# EAGLE schematic ATW-Farmcard (EAGLE 5.12)

## Sheet 1 of 2
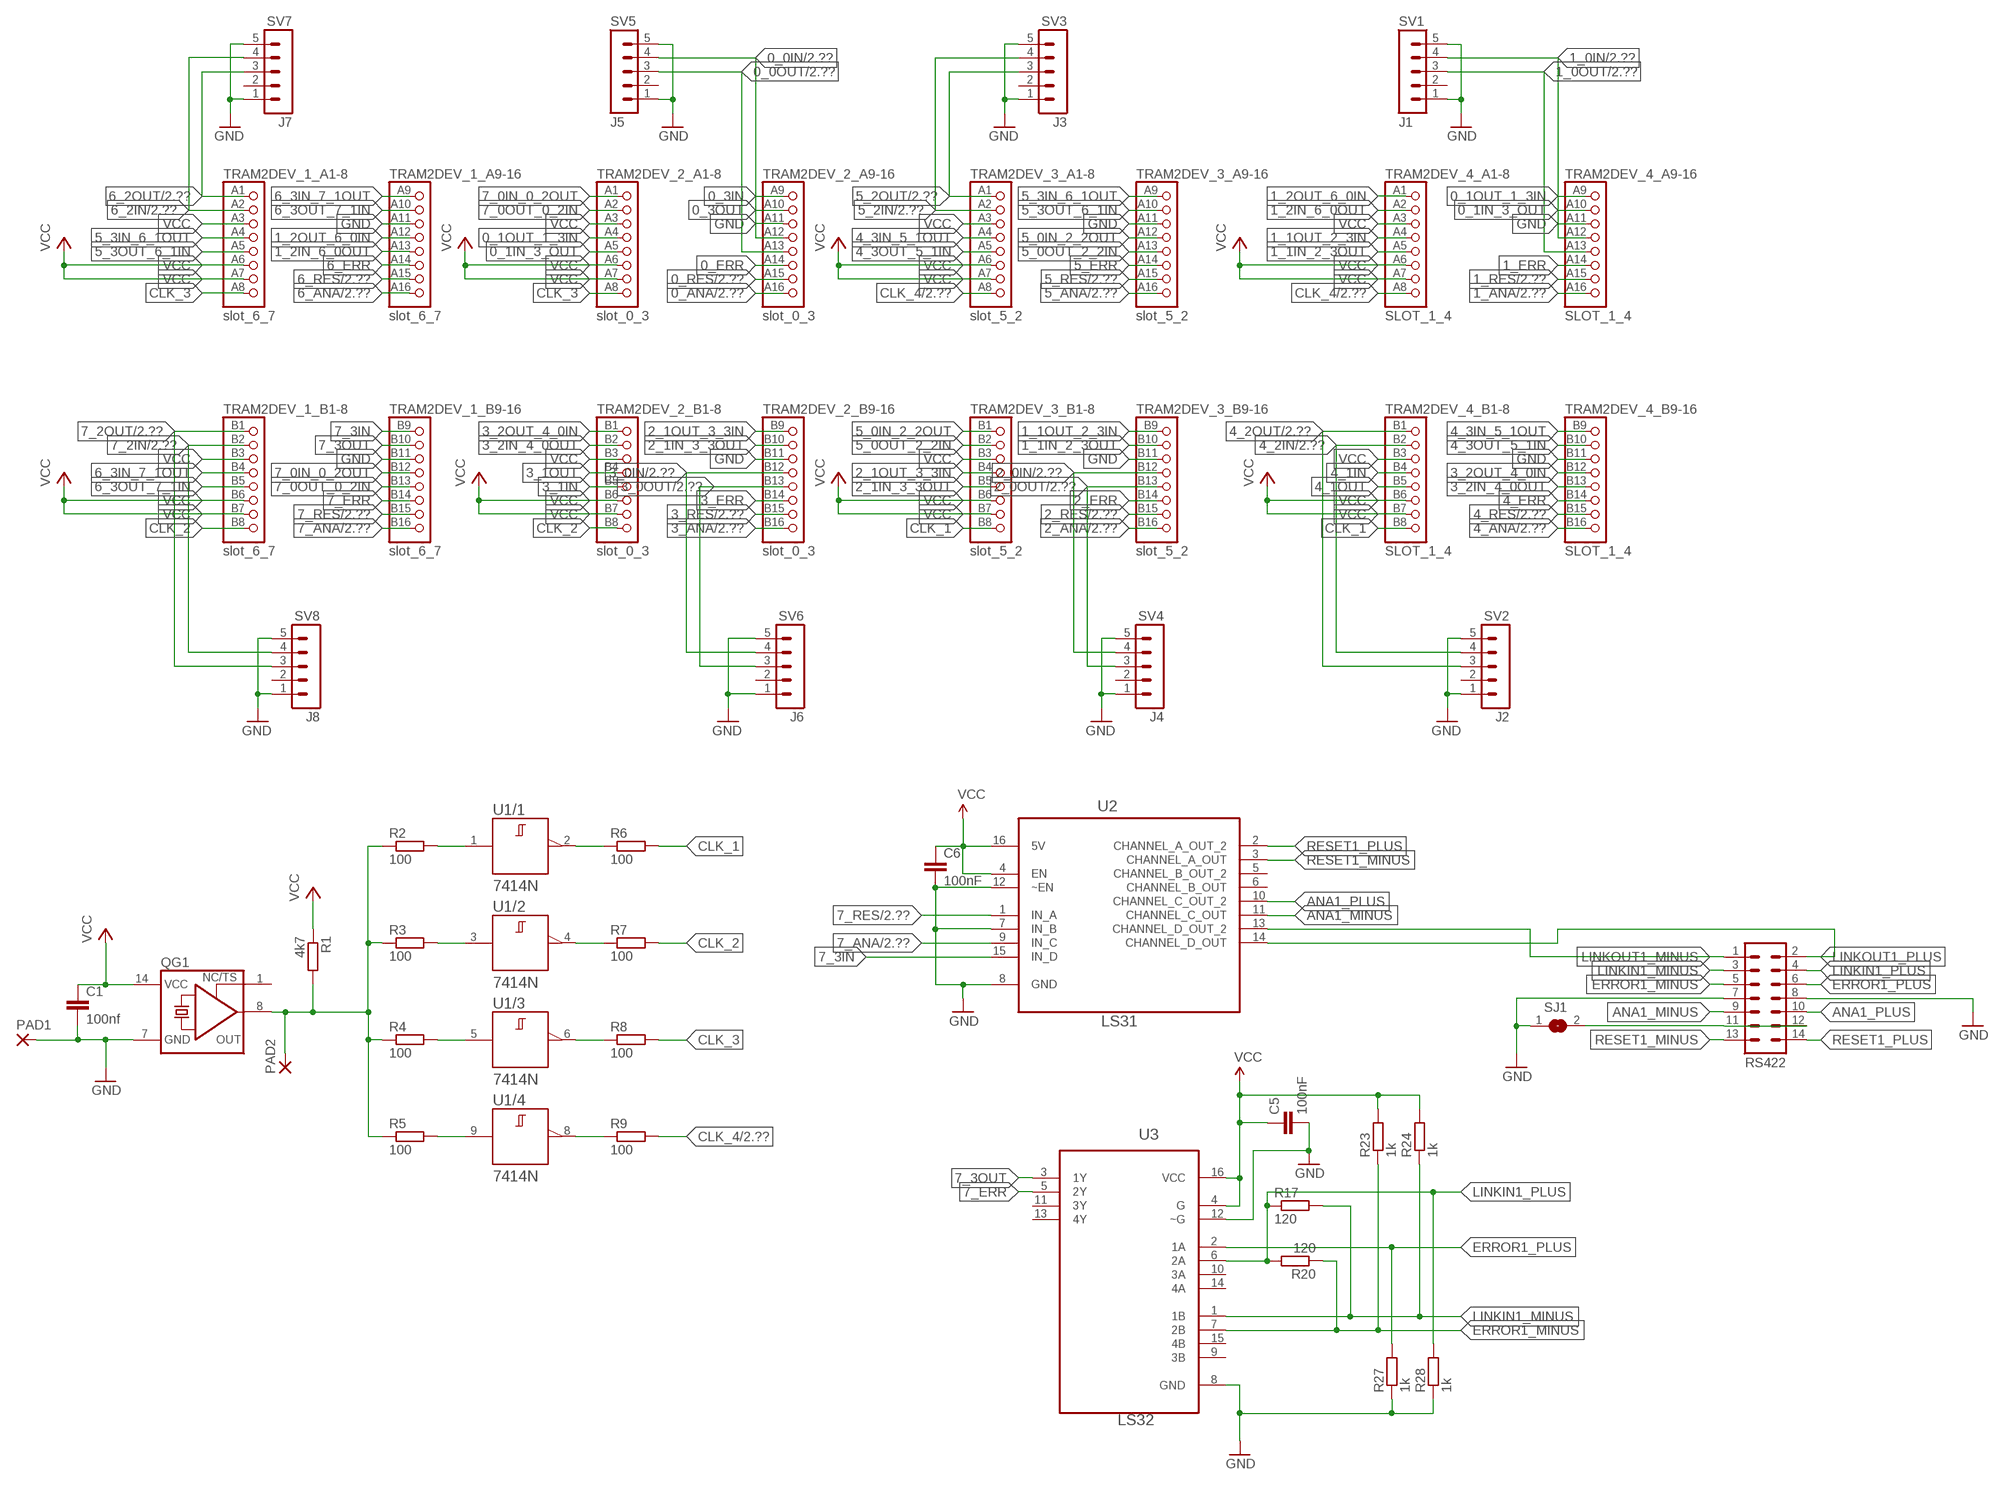
[diagram p0: schematic, sheet 1]

### Parts
C1  100nf  C-EU025-025X050  [C025-025X050]
C5  100nF  C-EU025-025X050  [C025-025X050]
C6  100nF  C-EU025-025X050  [C025-025X050]
PAD1  1,6/0,9  [1,6/0,9]
PAD2  1,6/0,9  [1,6/0,9]
QG1  XO-14  [DIL14S]
R1  4k7  R-EU_0204/5  [0204/5]
R2  100  R-EU_0204/5  [0204/5]
R3  100  R-EU_0204/5  [0204/5]
R4  100  R-EU_0204/5  [0204/5]
R5  100  R-EU_0204/5  [0204/5]
R6  100  R-EU_0204/5  [0204/5]
R7  100  R-EU_0204/5  [0204/5]
R8  100  R-EU_0204/5  [0204/5]
R9  100  R-EU_0204/5  [0204/5]
R17  120  R-EU_0204/5  [0204/5]
R20  120  R-EU_0204/5  [0204/5]
R23  1k  R-EU_0204/5  [0204/5]
R24  1k  R-EU_0204/5  [0204/5]
R27  1k  R-EU_0204/5  [0204/5]
R28  1k  R-EU_0204/5  [0204/5]
RS422  ML14L  [ML14L]
SJ1  SJ  [SJ]
SV1  J1  MA05-1  [MA05-1]
SV2  J2  MA05-1  [MA05-1]
SV3  J3  MA05-1  [MA05-1]
SV4  J4  MA05-1  [MA05-1]
SV5  J5  MA05-1  [MA05-1]
SV6  J6  MA05-1  [MA05-1]
SV7  J7  MA05-1  [MA05-1]
SV8  J8  MA05-1  [MA05-1]
TRAM2DEV_1  slot_6_7  TRAM2SOCK  [TRAM_SIZE2_SOCKET]
TRAM2DEV_2  slot_0_3  TRAM2SOCK  [TRAM_SIZE2_SOCKET]
TRAM2DEV_3  slot_5_2  TRAM2SOCK  [TRAM_SIZE2_SOCKET]
TRAM2DEV_4  SLOT_1_4  TRAM2SOCK  [TRAM_SIZE2_SOCKET]
U1  7414N  [DIL14]
U2  LS31  AM26LS31CN  [DIP254P762X508-16]
U3  LS32  AM26LS32IN  [DIP254P762X508-16]

### Nets
0_0IN: SV5.4 TRAM2DEV_2.A12 ; also sheet 2
0_0OUT: SV5.3 TRAM2DEV_2.A13 ; also sheet 2
0_1IN_3_OUT: TRAM2DEV_2.A5 TRAM2DEV_4.A10
0_1OUT_1_3IN: TRAM2DEV_2.A4 TRAM2DEV_4.A9
0_3IN: TRAM2DEV_2.A9
0_3OUT: TRAM2DEV_2.A10
0_ANA: TRAM2DEV_2.A16 ; also sheet 2
0_ERR: TRAM2DEV_2.A14
0_RES: TRAM2DEV_2.A15 ; also sheet 2
1_0IN: SV1.4 TRAM2DEV_4.A12 ; also sheet 2
1_0OUT: SV1.3 TRAM2DEV_4.A13 ; also sheet 2
1_1IN_2_3OUT: TRAM2DEV_3.B10 TRAM2DEV_4.A5
1_1OUT_2_3IN: TRAM2DEV_3.B9 TRAM2DEV_4.A4
1_2IN_6_0OUT: TRAM2DEV_1.A13 TRAM2DEV_4.A2
1_2OUT_6_0IN: TRAM2DEV_1.A12 TRAM2DEV_4.A1
1_ANA: TRAM2DEV_4.A16 ; also sheet 2
1_ERR: TRAM2DEV_4.A14
1_RES: TRAM2DEV_4.A15 ; also sheet 2
2_0IN: SV4.4 TRAM2DEV_3.B12 ; also sheet 2
2_0OUT: SV4.3 TRAM2DEV_3.B13 ; also sheet 2
2_1IN_3_3OUT: TRAM2DEV_2.B10 TRAM2DEV_3.B5
2_1OUT_3_3IN: TRAM2DEV_2.B9 TRAM2DEV_3.B4
2_ANA: TRAM2DEV_3.B16 ; also sheet 2
2_ERR: TRAM2DEV_3.B14
2_RES: TRAM2DEV_3.B15 ; also sheet 2
3_0IN: SV6.4 TRAM2DEV_2.B12 ; also sheet 2
3_0OUT: SV6.3 TRAM2DEV_2.B13 ; also sheet 2
3_1IN: TRAM2DEV_2.B5
3_1OUT: TRAM2DEV_2.B4
3_2IN_4_0OUT: TRAM2DEV_2.B2 TRAM2DEV_4.B13
3_2OUT_4_0IN: TRAM2DEV_2.B1 TRAM2DEV_4.B12
3_ANA: TRAM2DEV_2.B16 ; also sheet 2
3_ERR: TRAM2DEV_2.B14
3_RES: TRAM2DEV_2.B15 ; also sheet 2
4_1IN: TRAM2DEV_4.B4
4_1OUT: TRAM2DEV_4.B5
4_2IN: SV2.4 TRAM2DEV_4.B2 ; also sheet 2
4_2OUT: SV2.3 TRAM2DEV_4.B1 ; also sheet 2
4_3IN_5_1OUT: TRAM2DEV_3.A4 TRAM2DEV_4.B9
4_3OUT_5_1IN: TRAM2DEV_3.A5 TRAM2DEV_4.B10
4_ANA: TRAM2DEV_4.B16 ; also sheet 2
4_ERR: TRAM2DEV_4.B14
4_RES: TRAM2DEV_4.B15 ; also sheet 2
5_0IN_2_2OUT: TRAM2DEV_3.A12 TRAM2DEV_3.B1
5_0OUT_2_2IN: TRAM2DEV_3.A13 TRAM2DEV_3.B2
5_2IN: SV3.4 TRAM2DEV_3.A2 ; also sheet 2
5_2OUT: SV3.3 TRAM2DEV_3.A1 ; also sheet 2
5_3IN_6_1OUT: TRAM2DEV_1.A4 TRAM2DEV_3.A9
5_3OUT_6_1IN: TRAM2DEV_1.A5 TRAM2DEV_3.A10
5_ANA: TRAM2DEV_3.A16 ; also sheet 2
5_ERR: TRAM2DEV_3.A14
5_RES: TRAM2DEV_3.A15 ; also sheet 2
6_2IN: SV7.4 TRAM2DEV_1.A2 ; also sheet 2
6_2OUT: SV7.3 TRAM2DEV_1.A1 ; also sheet 2
6_3IN_7_1OUT: TRAM2DEV_1.A9 TRAM2DEV_1.B4
6_3OUT_7_1IN: TRAM2DEV_1.A10 TRAM2DEV_1.B5
6_ANA: TRAM2DEV_1.A16 ; also sheet 2
6_ERR: TRAM2DEV_1.A14
6_RES: TRAM2DEV_1.A15 ; also sheet 2
7_0IN_0_2OUT: TRAM2DEV_1.B12 TRAM2DEV_2.A1
7_0OUT_0_2IN: TRAM2DEV_1.B13 TRAM2DEV_2.A2
7_2IN: SV8.4 TRAM2DEV_1.B2 ; also sheet 2
7_2OUT: SV8.3 TRAM2DEV_1.B1 ; also sheet 2
7_3IN: TRAM2DEV_1.B9 U2.15(IN_D)
7_3OUT: TRAM2DEV_1.B10 U3.3(1Y)
7_ANA: TRAM2DEV_1.B16 U2.9(IN_C) ; also sheet 2
7_ERR: TRAM2DEV_1.B14 U3.5(2Y)
7_RES: TRAM2DEV_1.B15 U2.1(IN_A) ; also sheet 2
ANA1_MINUS: RS422.9 U2.11(CHANNEL_C_OUT)
ANA1_PLUS: RS422.10 U2.10(CHANNEL_C_OUT_2)
CLK_1: R6.2 TRAM2DEV_3.B8 TRAM2DEV_4.B8
CLK_2: R7.2 TRAM2DEV_1.B8 TRAM2DEV_2.B8
CLK_3: R8.2 TRAM2DEV_1.A8 TRAM2DEV_2.A8
CLK_4: R9.2 TRAM2DEV_3.A8 TRAM2DEV_4.A8 ; also sheet 2
ERROR1_MINUS: R20.1 R23.1 RS422.5 U3.7(2B)
ERROR1_PLUS: R20.2 R27.2 RS422.6 U3.6(2A)
GND: C1.2 C5.2 C6.2 PAD1.1(P) QG1.7(GND) R27.1 R28.1 RS422.7 RS422.8 SJ1.1 SV1.1 SV1.5 SV2.1 SV2.5 SV3.1 SV3.5 SV4.1 SV4.5 SV5.1 SV5.5 SV6.1 SV6.5 SV7.1 SV7.5 SV8.1 SV8.5 TRAM2DEV_1.A11 TRAM2DEV_1.B11 TRAM2DEV_2.A11 TRAM2DEV_2.B11 TRAM2DEV_3.A11 TRAM2DEV_3.B11 TRAM2DEV_4.A11 TRAM2DEV_4.B11 U2.7(IN_B) U2.8(GND) U2.12(~EN) U3.8(GND) U3.12(~G) ; also sheet 2
LINKIN1_MINUS: R17.2 R24.1 RS422.3 U3.1(1B)
LINKIN1_PLUS: R17.1 R28.2 RS422.4 U3.2(1A)
LINKOUT1_MINUS: RS422.1 U2.13(CHANNEL_D_OUT_2)
LINKOUT1_PLUS: RS422.2 U2.14(CHANNEL_D_OUT)
N$1: PAD2.1(P) QG1.8(OUT) R1.2 R2.1 R3.1 R4.1 R5.1
N$2: R2.2 U1.1(/1:A)
N$3: R3.2 U1.3(/2:A)
N$4: R4.2 U1.5(/3:A)
N$5: R5.2 U1.9(/4:A)
N$6: R9.1 U1.8(/4:Y)
N$7: R8.1 U1.6(/3:Y)
N$8: R7.1 U1.4(/2:Y)
N$9: R6.1 U1.2(/1:Y)
N$18: RS422.11 RS422.12 SJ1.2
RESET1_MINUS: RS422.13 U2.3(CHANNEL_A_OUT)
RESET1_PLUS: RS422.14 U2.2(CHANNEL_A_OUT_2)
VCC: C1.1 C5.1 C6.1 QG1.14(VCC) R1.1 R23.2 R24.2 TRAM2DEV_1.A3 TRAM2DEV_1.A6 TRAM2DEV_1.A7 TRAM2DEV_1.B3 TRAM2DEV_1.B6 TRAM2DEV_1.B7 TRAM2DEV_2.A3 TRAM2DEV_2.A6 TRAM2DEV_2.A7 TRAM2DEV_2.B3 TRAM2DEV_2.B6 TRAM2DEV_2.B7 TRAM2DEV_3.A3 TRAM2DEV_3.A6 TRAM2DEV_3.A7 TRAM2DEV_3.B3 TRAM2DEV_3.B6 TRAM2DEV_3.B7 TRAM2DEV_4.A3 TRAM2DEV_4.A6 TRAM2DEV_4.A7 TRAM2DEV_4.B3 TRAM2DEV_4.B6 TRAM2DEV_4.B7 U2.4(EN) U2.16(5V) U3.4(G) U3.16(VCC) ; also sheet 2
Unconnected: QG1.1(TS) SV1.2 SV2.2 SV3.2 SV4.2 SV5.2 SV6.2 SV7.2 SV8.2 U1.10(/5:Y) U1.11(/5:A) U1.12(/6:Y) U1.13(/6:A) U2.5(CHANNEL_B_OUT_2) U2.6(CHANNEL_B_OUT) U3.9(3B) U3.10(3A) U3.11(3Y) U3.13(4Y) U3.14(4A) U3.15(4B)

## Sheet 2 of 2
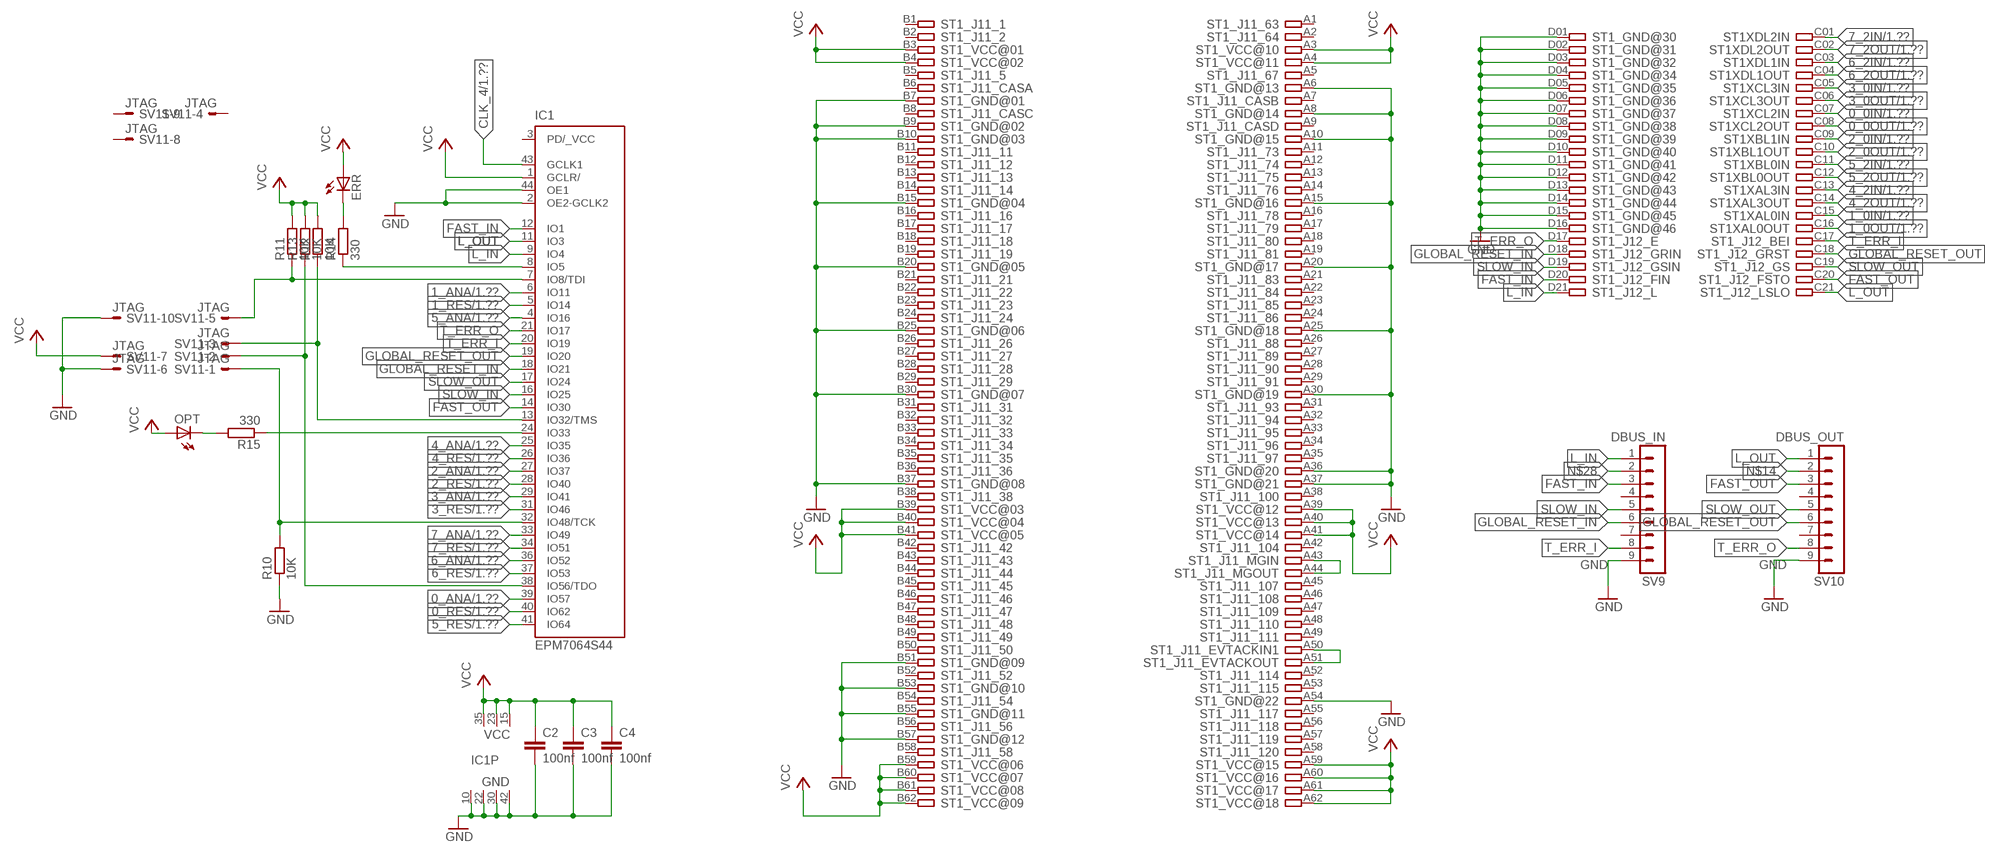
[diagram p1: schematic, sheet 2]

### Parts
C2  100nf  C-EU025-025X050  [C025-025X050]
C3  100nf  C-EU025-025X050  [C025-025X050]
C4  100nf  C-EU025-025X050  [C025-025X050]
ERR  LED3MM  [LED3MM]
IC1  EPM7064S44  [PLCC-S44]
OPT  LED3MM  [LED3MM]
R10  10K  R-EU_0204/5  [0204/5]
R11  10K  R-EU_0204/5  [0204/5]
R12  10K  R-EU_0204/5  [0204/5]
R13  10K  R-EU_0204/5  [0204/5]
R14  330  R-EU_0204/5  [0204/5]
R15  330  R-EU_0204/5  [0204/5]
ST1  ATW_FARMCARD  [ATW_FARMCARD]
SV9  DBUS_IN  MA09-1  [MA09-1]
SV10  DBUS_OUT  MA09-1  [MA09-1]
SV11  JTAG  ML10E  [ML10]

### Nets
0_0IN: ST1.C07 ; also sheet 1
0_0OUT: ST1.C08 ; also sheet 1
0_ANA: IC1.39(IO57) ; also sheet 1
0_RES: IC1.40(IO62) ; also sheet 1
1_0IN: ST1.C15 ; also sheet 1
1_0OUT: ST1.C16 ; also sheet 1
1_ANA: IC1.6(IO11) ; also sheet 1
1_RES: IC1.5(IO14) ; also sheet 1
2_0IN: ST1.C09 ; also sheet 1
2_0OUT: ST1.C10 ; also sheet 1
2_ANA: IC1.27(IO37) ; also sheet 1
2_RES: IC1.28(IO40) ; also sheet 1
3_0IN: ST1.C05 ; also sheet 1
3_0OUT: ST1.C06 ; also sheet 1
3_ANA: IC1.29(IO41) ; also sheet 1
3_RES: IC1.31(IO46) ; also sheet 1
4_2IN: ST1.C13 ; also sheet 1
4_2OUT: ST1.C14 ; also sheet 1
4_ANA: IC1.25(IO35) ; also sheet 1
4_RES: IC1.26(IO36) ; also sheet 1
5_2IN: ST1.C11 ; also sheet 1
5_2OUT: ST1.C12 ; also sheet 1
5_ANA: IC1.4(IO16) ; also sheet 1
5_RES: IC1.41(IO64) ; also sheet 1
6_2IN: ST1.C03 ; also sheet 1
6_2OUT: ST1.C04 ; also sheet 1
6_ANA: IC1.36(IO52) ; also sheet 1
6_RES: IC1.37(IO53) ; also sheet 1
7_2IN: ST1.C01 ; also sheet 1
7_2OUT: ST1.C02 ; also sheet 1
7_ANA: IC1.33(IO49) ; also sheet 1
7_RES: IC1.34(IO51) ; also sheet 1
CLK_4: IC1.43(GCLK1) ; also sheet 1
FAST_IN: IC1.12(IO1) ST1.D20 SV9.3
FAST_OUT: IC1.14(IO30) ST1.C20 SV10.3
GLOBAL_RESET_IN: IC1.18(IO21) ST1.D18 SV9.6
GLOBAL_RESET_OUT: IC1.19(IO20) ST1.C18 SV10.6
GND: C2.2 C3.2 C4.2 IC1.2(OE2-GCLK2) IC1.10(GND) IC1.22(GND) IC1.30(GND) IC1.42(GND) IC1.44(OE1) R10.1 ST1.A6 ST1.A8 ST1.A10 ST1.A15 ST1.A20 ST1.A25 ST1.A30 ST1.A36 ST1.A37 ST1.A54 ST1.B7 ST1.B9 ST1.B10 ST1.B15 ST1.B20 ST1.B25 ST1.B30 ST1.B37 ST1.B51 ST1.B53 ST1.B55 ST1.B57 ST1.D01 ST1.D02 ST1.D03 ST1.D04 ST1.D05 ST1.D06 ST1.D07 ST1.D08 ST1.D09 ST1.D10 ST1.D11 ST1.D12 ST1.D13 ST1.D14 ST1.D15 ST1.D16 SV9.9 SV10.9 SV11.6 SV11.10 ; also sheet 1
L_IN: IC1.9(IO4) ST1.D21 SV9.1
L_OUT: IC1.11(IO3) ST1.C21 SV10.1
N$10: ERR.K(C) R14.2
N$11: IC1.8(IO5) R14.1
N$12: ST1.A50 ST1.A51
N$13: IC1.24(IO33) R15.1
N$14: SV10.2
N$15: ST1.A43 ST1.A44
N$16: OPT.K(C) R15.2
N$20: IC1.32(IO48/TCK) R10.2 SV11.1
N$24: IC1.38(IO56/TDO) R13.1 SV11.2
N$25: IC1.13(IO32/TMS) R12.1 SV11.3
N$26: IC1.7(IO8/TDI) R11.1 SV11.5
N$28: SV9.2
SLOW_IN: IC1.16(IO25) ST1.D19 SV9.5
SLOW_OUT: IC1.17(IO24) ST1.C19 SV10.5
T_ERR_I: IC1.20(IO19) ST1.C17 SV9.8
T_ERR_O: IC1.21(IO17) ST1.D17 SV10.8
VCC: C2.1 C3.1 C4.1 ERR.A IC1.1(GCLR/) IC1.15(VCC) IC1.23(VCC) IC1.35(VCC) OPT.A R11.2 R12.2 R13.2 ST1.A3 ST1.A4 ST1.A39 ST1.A40 ST1.A41 ST1.A59 ST1.A60 ST1.A61 ST1.A62 ST1.B3 ST1.B4 ST1.B39 ST1.B40 ST1.B41 ST1.B59 ST1.B60 ST1.B61 ST1.B62 SV11.7 ; also sheet 1
Unconnected: IC1.3(PD/_VCC) ST1.A1 ST1.A2 ST1.A5 ST1.A7 ST1.A9 ST1.A11 ST1.A12 ST1.A13 ST1.A14 ST1.A16 ST1.A17 ST1.A18 ST1.A19 ST1.A21 ST1.A22 ST1.A23 ST1.A24 ST1.A26 ST1.A27 ST1.A28 ST1.A29 ST1.A31 ST1.A32 ST1.A33 ST1.A34 ST1.A35 ST1.A38 ST1.A42 ST1.A45 ST1.A46 ST1.A47 ST1.A48 ST1.A49 ST1.A52 ST1.A53 ST1.A55 ST1.A56 ST1.A57 ST1.A58 ST1.B1 ST1.B2 ST1.B5 ST1.B6 ST1.B8 ST1.B11 ST1.B12 ST1.B13 ST1.B14 ST1.B16 ST1.B17 ST1.B18 ST1.B19 ST1.B21 ST1.B22 ST1.B23 ST1.B24 ST1.B26 ST1.B27 ST1.B28 ST1.B29 ST1.B31 ST1.B32 ST1.B33 ST1.B34 ST1.B35 ST1.B36 ST1.B38 ST1.B42 ST1.B43 ST1.B44 ST1.B45 ST1.B46 ST1.B47 ST1.B48 ST1.B49 ST1.B50 ST1.B52 ST1.B54 ST1.B56 ST1.B58 SV9.4 SV9.7 SV10.4 SV10.7 SV11.4 SV11.8 SV11.9

## Power pins joined to a net without a drawn wire
+UB: U1.14(/+UB:+UB)
-UB: U1.7(/-UB:-UB)

## Library data of the parts
C1-C6 = rcl:C-EU: CAPACITOR, European symbol
ERR OPT = led:LED: LED OSRAM: - CHIPLED LG R971, LG N971, LY N971, LG Q971, LY Q971, LO R971, LY R971 LH N974, LH R974 LS Q976, LO Q976, LY Q976 LO Q996 - Hyper CHIPLED LW Q18S LB Q993, LB Q99A, LB R99A - SideLED LS A670, LO A670, LY A670, LG A670, LP A670 LB A673, LV A673, LT A673, LW A673 LH A674 LY A675 LS A676, LA A676, LO A676, LY A676, LW A676 LS A679, LY A679, LG A679 - Hyper Micro SIDELED® LS Y876, LA Y876, LO Y876, LY Y876 LT Y87S - SmartLED LW L88C, LW L88S LB L89C, LB L89S, LG L890 LS L89K, LO L89K, LY L89K LS L896, LA L896, LO L896, LY L896 - TOPLED LS T670, LO T670, LY T670, LG T670, LP T670 LSG T670, LSP T670, LSY T670, LOP T670, LYG T670 LG T671, LOG T671, LSG T671 LB T673, LV T673, LT T673, LW T673 LH T674 LS T676, LA T676, LO T676, LY T676, LB T676, LH T676, LSB T676, LW T676 LB T67C, LV T67C, LT T67C, LS T67K, LO T67K, LY T67K, LW E67C LS E67B, LA E67B, LO E67B, LY E67B, LB E67C, LV E67C, LT E67C LW T67C LS T679, LY T679, LG T679 LS T770, LO T770, LY T770, LG T770, LP T770 LB T773, LV T773, LT T773, LW T773 LH T774 LS E675, LA E675, LY E675, LS T675 LS T776, LA T776, LO T776, LY T776, LB T776 LHGB T686 LT T68C, LB T68C - Hyper Mini TOPLED® LB M676 - Mini TOPLED Santana® LG M470 LS M47K, LO M47K, LY M47K Source: http://www.osram.convergy.de LUXEON: - LUMILED® LXK2-PW12-R00, LXK2-PW12-S00, LXK2-PW14-U00, LXK2-PW14-V00 LXK2-PM12-R00, LXK2-PM12-S00, LXK2-PM14-U00 LXK2-PE12-Q00, LXK2-PE12-R00, LXK2-PE12-S00, LXK2-PE14-T00, LXK2-PE14-U00 LXK2-PB12-K00, LXK2-PB12-L00, LXK2-PB12-M00, LXK2-PB14-N00, LXK2-PB14-P00, LXK2-PB14-Q00 LXK2-PR12-L00, LXK2-PR12-M00, LXK2-PR14-Q00, LXK2-PR14-R00 LXK2-PD12-Q00, LXK2-PD12-R00, LXK2-PD12-S00 LXK2-PH12-R00, LXK2-PH12-S00 LXK2-PL12-P00, LXK2-PL12-Q00, LXK2-PL12-R00 Source: www.luxeon.com KINGBRIGHT: KA-3528ASYC Source: www.kingbright.com
IC1 = altera:EPM7064: EPM7064 MAX 7000 family; MPN: EPM7064SLC44-10N; OC_FARNELL: 1549449; OC_NEWARK: 51R0526
PAD1 PAD2 = wirepad:1,6/0,9: THROUGH-HOLE PAD
QG1 = crystal:XO-: CRYSTAL; OC_FARNELL: unknown; OC_NEWARK: unknown
R1-R15 R17 R20 R23 R24 R27 R28 = rcl:R-EU_: RESISTOR, European symbol
RS422 = con-ml:ML14L: HARTING; OC_FARNELL: unknown; OC_NEWARK: unknown
SJ1 = jumper:SJ: SMD solder JUMPER
ST1 = axels:ATW_FARMCARD: FarmCard for the ATARI ATW800
SV1-SV8 = con-lstb:MA05-1: PIN HEADER; OC_FARNELL: unknown; OC_NEWARK: unknown
SV9 SV10 = con-lstb:MA09-1: PIN HEADER; OC_FARNELL: unknown; OC_NEWARK: unknown
SV11 = con-ml:ML10E: HARTING; OC_FARNELL: unknown; OC_NEWARK: unknown
TRAM2DEV_1-TRAM2DEV_4 = axels:TRAM2SOCK: Socket for 2 TRAM size-1 boards INMOS Standard Transputer Boards Simplified version w/o cut-outs Drill diameter is the standard 0.045 inch!! Source: The Transputer development and iq systems Databook 1991.
U1 = 74ttl-din:74*14: Hex schmitt trigger INVERTER
U2 = axels:AM26LS31CN: Line Driver; MPN: DS26LS31CN; OC_FARNELL: 9487867; OC_NEWARK: 41K1835; PACKAGE: 16-DIP; SUPPLIER: National Semiconductor
U3 = axels:AM26LS32IN: QUADRUPLE DIFFERENTIAL LINE RECEIVERS; MPN: AM26C32IN; OC_FARNELL: 1295964; OC_NEWARK: 74C7309; PACKAGE: PDIP-16; SUPPLIER: Texas Instruments